# EAGLE design sparrow_ble (EAGLE 7.5.0)
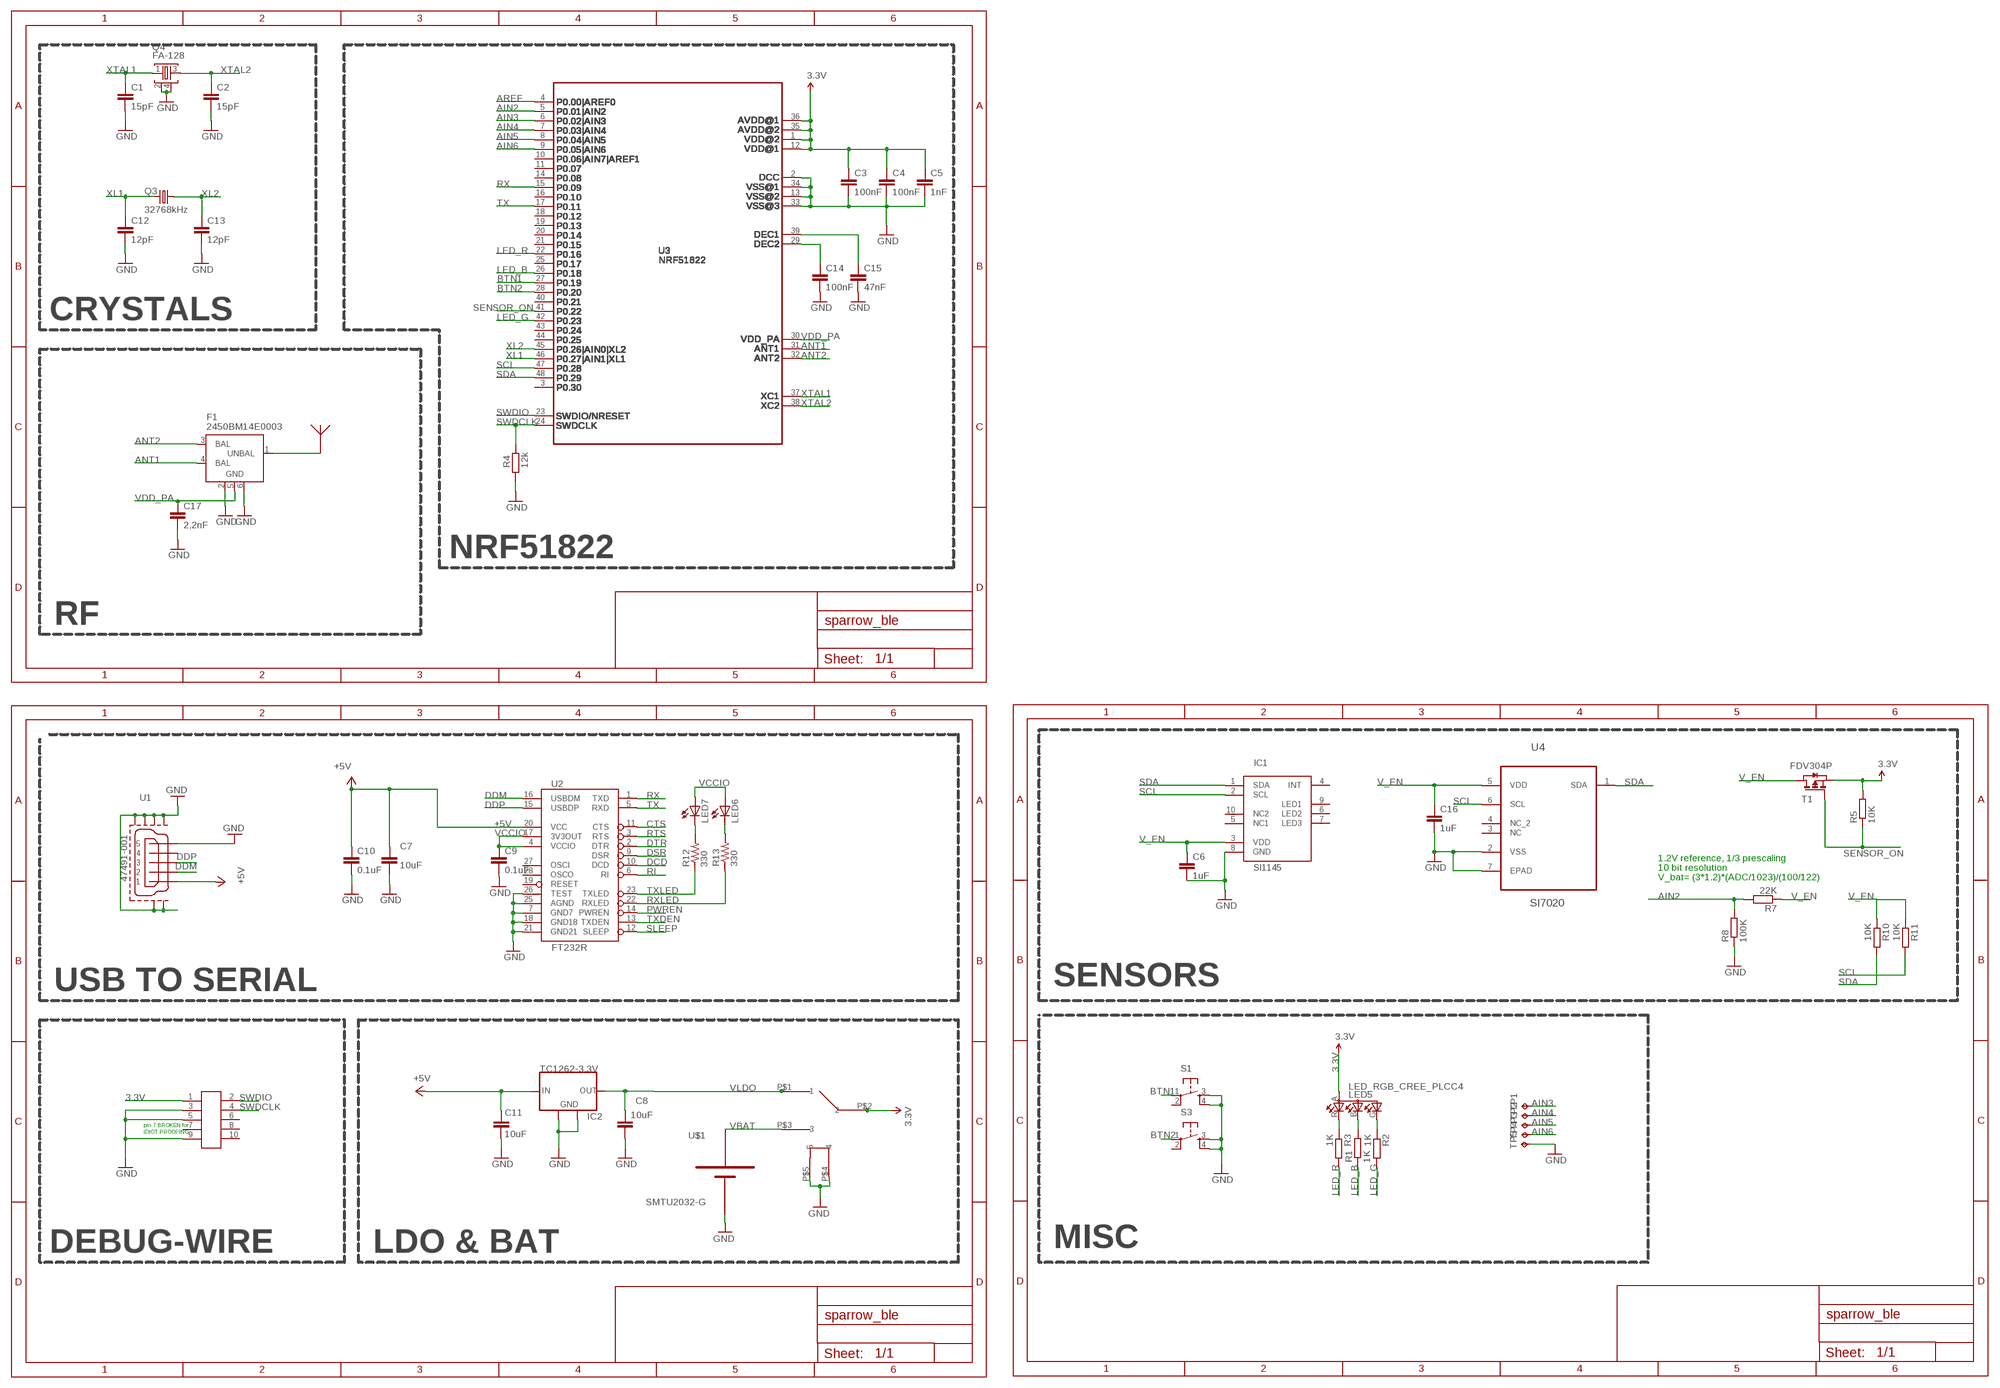
[diagram p0: schematic, sheet 1]

## Parts
C1  15pF  C-EUC0402  [C0402]
C2  15pF  C-EUC0402  [C0402]
C3  100nF  C-EUC0402  [C0402]
C4  100nF  C-EUC0402  [C0402]
C5  1nF  C-EUC0402  [C0402]
C6  1uF  C-EUC0402  [C0402]
C7  10uF  C-EUC0402  [C0402]
C8  10uF  C-EUC0402  [C0402]
C9  0.1uF  CAP0402-CAP  [0402-CAP]
C10  0.1uF  CAP0402-CAP  [0402-CAP]
C11  10uF  C-EUC0402  [C0402]
C12  12pF  C-EUC0402  [C0402]
C13  12pF  C-EUC0402  [C0402]
C14  100nF  C-EUC0402  [C0402]
C15  47nF  C-EUC0402  [C0402]
C16  1uF  C-EUC0402  [C0402]
C17  2,2nF  C-EUC0402  [C0402]
F1  2450BM14E0003  2450BM15A0002  [2450BM15A0002]
IC1  SI1145  [QFN10]
IC2  TC1262-3.3V  MCP1825S-SOT223  [SOT223]
J3  SMALL_HEADER_5X2  [SAMTEC_5X2]
LED5  LED_RGB_CREE_PLCC4  [P-LCC-4-4]
LED6  LEDCHIP-LED0603  [CHIP-LED0603]
LED7  LEDCHIP-LED0603  [CHIP-LED0603]
Q3  32768kHz  FC-12M  [FC-12M]
Q4  FA-128  [FA-128]
R1  1K  R-EU_R0402  [R0402]
R2  1K  R-EU_R0402  [R0402]
R3  1K  R-EU_R0402  [R0402]
R4  12k  R-EU_R0402  [R0402]
R5  10K  R-EU_R0402  [R0402]
R7  22K  R-EU_R0402  [R0402]
R8  100K  R-EU_R0402  [R0402]
R10  10K  R-EU_R0402  [R0402]
R11  10K  R-EU_R0402  [R0402]
R12  330  RESISTOR0402-RES  [0402-RES]
R13  330  RESISTOR0402-RES  [0402-RES]
S1  TAC_SWITCHSMD  [TACTILE-SWITCH-SMD]
S3  TAC_SWITCHSMD  [TACTILE-SWITCH-SMD]
T1  FDV304P  PMOSSOT23  [SOT-23]
TP1  TPTP16R  [TP16R]
TP2  TPTP16R  [TP16R]
TP3  TPTP16R  [TP16R]
TP4  TPTP16R  [TP16R]
TP5  TPTP16R  [TP16R]
U1  47491-001  [47491-0001]
U2  FT232R  FT232RLSSOP  [SSOP28DB]
U3  NRF51822  [NRF51822-QFN48]
U4  SI7020  SHT21  [DFN300X300X110-7N]
U8  ANTENNA  [ANTPACK]
U$1  SMTU2032-G  [SMTU2032-G]
U$2  SWITCH  [PCM12]

## Nets
3.3V: C3.1 C4.1 C5.1 J3.1 LED5.A(A2) R5.2 T1.2(S) U3.1 U3.12 U3.35 U3.36 U$2.P$2
+5V [power]: C7.1 C10.1 C11.1 IC2.1(IN) U1.1 U2.20(VCC)
AIN2: R7.2 R8.2 U3.5
AIN3: TP1.TP U3.6
AIN4: TP2.TP U3.7
AIN5: TP3.TP U3.8
AIN6: TP4.TP U3.9
ANT1: F1.4(BAL) U3.31
ANT2: F1.3(BAL) U3.32
AREF: U3.4
BTN1: S1.1 U3.27
BTN2: S3.1 U3.28
CTS: U2.11(CTS)
DCD: U2.10(DCD)
DDM: U1.2 U2.16(USBDM)
DDP: U1.3 U2.15(USBDP)
DSR: U2.9(DSR)
DTR: U2.2(DTR)
GND: C1.2 C2.2 C3.2 C4.2 C5.2 C6.2 C7.2 C8.2 C9.2 C10.2 C11.2 C12.2 C13.2 C14.2 C15.2 C16.2 C17.2 F1.2(GND) F1.6(GND) IC1.8(GND) IC2.2(GND) IC2.4(GND) J3.3 J3.5 J3.9 Q4.2 Q4.4 R4.1 R8.1 S1.3 S1.4 S3.3 S3.4 TP5.TP U1.5 U1.GND1 U1.GND2 U1.GND3 U1.GND4 U1.GND5 U1.GND6 U2.7(GND7) U2.18(GND18) U2.21(GND21) U2.25(AGND) U2.26(TEST) U3.2 U3.13 U3.33 U3.34 U4.2(VSS) U4.7(EPAD) U$1.2 U$2.P$4 U$2.P$5
LED_B: R1.1 U3.26
LED_G: R2.2 U3.42
LED_R: R3.2 U3.22
N$1: LED5.R(CRED) R3.1
N$2: LED5.G(CGREEN) R2.1
N$3: C14.1 U3.29
N$4: C15.1 U3.39
N$5: LED7.C R12.2
N$6: LED6.C R13.2
N$9: LED5.B(CBLUE) R1.2
N$10: F1.1(UNBAL) U8.P$1
PWREN: U2.14(PWREN)
RI: U2.6(RI)
RTS: U2.3(RTS)
RX: U2.1(TXD) U3.15
RXLED: R13.1 U2.22(RXLED)
SCL: IC1.2(SCL) R11.2 U3.47 U4.6(SCL)
SDA: IC1.1(SDA) R10.2 U3.48 U4.1(SDA)
SENSOR_ON: R5.1 T1.3(G) U3.41
SLEEP: U2.12(SLEEP)
SWDCLK: J3.4 R4.2 U3.24
SWDIO: J3.2 U3.23
TX: U2.5(RXD) U3.17
TXDEN: U2.13(TXDEN)
TXLED: R12.1 U2.23(TXLED)
V_EN: C6.1 C16.1 IC1.3(VDD) R7.1 R10.1 R11.1 T1.1(D) U4.5(VDD)
VBAT: U$1.1 U$2.P$3
VCCIO: C9.1 LED6.A LED7.A U2.4(VCCIO) U2.17(3V3OUT)
VDD_PA: C17.1 F1.5(GND) U3.30
VLDO: C8.1 IC2.3(OUT) U$2.P$1
XL1: C12.1 Q3.2 U3.46
XL2: C13.1 Q3.1 U3.45
XTAL1: C1.1 Q4.1 U3.37
XTAL2: C2.1 Q4.3 U3.38
Unconnected: IC1.4(INT) IC1.5(NC1) IC1.6(LED2) IC1.7(LED3) IC1.9(LED1) IC1.10(NC2) J3.6 J3.7 J3.8 J3.10 S1.2 S3.2 U1.4 U2.19(RESET) U2.27(OSCI) U2.28(OSCO) U3.3 U3.10 U3.11 U3.14 U3.16 U3.18 U3.19 U3.20 U3.21 U3.25 U3.40 U3.43 U3.44 U4.3(NC) U4.4(NC_2)

## Notes on the sheet
- CRYSTALS
- NRF51822
- RF
- 1.2V reference, 1/3 prescaling
- 10 bit resolution
- V_bat= (3*1.2)*(ADC/1023)/(100/122)
- USB TO SERIAL | SENSORS
- pin 7 BROKEN for
- IDIOT PROOFING
- DEBUG-WIRE | LDO & BAT | MISC

## Library data of the parts
C1-C6 C12-C17 = resistor:C-EU: CAPACITOR, European symbol
C7 C8 C11 = rcl:C-EU: CAPACITOR, European symbol
C9 C10 = SparkFun:CAP: Capacitor Standard 0603 ceramic capacitor, and 0.1" leaded capacitor.
F1 = johanson:2450BM15A0002: 2.45 GHz Impedance Matched Balun-Filter For TI CC253X/CC2540 Chipset family Data sheet <http://www.johansontechnology.com/images/stories/ip/baluns/balun_filter_combo_matched_2450bm15a0002_v8.pdf>
IC1 = dan:SI1145
IC2 = Spark:MCP1825S: 500 mA, Low Voltage, Low Quiescent Current LDO Regulator
J3 = 0andrei_custom:SMALL_HEADER_5X2
LED5 = led:LED_RGB_CREE_PLCC4
LED6 LED7 = led:LED: LED OSRAM: - CHIPLED LG R971, LG N971, LY N971, LG Q971, LY Q971, LO R971, LY R971 LH N974, LH R974 LS Q976, LO Q976, LY Q976 LO Q996 - Hyper CHIPLED LW Q18S LB Q993, LB Q99A, LB R99A - SideLED LS A670, LO A670, LY A670, LG A670, LP A670 LB A673, LV A673, LT A673, LW A673 LH A674 LY A675 LS A676, LA A676, LO A676, LY A676, LW A676 LS A679, LY A679, LG A679 - Hyper Micro SIDELED® LS Y876, LA Y876, LO Y876, LY Y876 LT Y87S - SmartLED LW L88C, LW L88S LB L89C, LB L89S, LG L890 LS L89K, LO L89K, LY L89K LS L896, LA L896, LO L896, LY L896 - TOPLED LS T670, LO T670, LY T670, LG T670, LP T670 LSG T670, LSP T670, LSY T670, LOP T670, LYG T670 LG T671, LOG T671, LSG T671 LB T673, LV T673, LT T673, LW T673 LH T674 LS T676, LA T676, LO T676, LY T676, LB T676, LH T676, LSB T676, LW T676 LB T67C, LV T67C, LT T67C, LS T67K, LO T67K, LY T67K, LW E67C LS E67B, LA E67B, LO E67B, LY E67B, LB E67C, LV E67C, LT E67C LW T67C LS T679, LY T679, LG T679 LS T770, LO T770, LY T770, LG T770, LP T770 LB T773, LV T773, LT T773, LW T773 LH T774 LS E675, LA E675, LY E675, LS T675 LS T776, LA T776, LO T776, LY T776, LB T776 LHGB T686 LT T68C, LB T68C - Hyper Mini TOPLED® LB M676 - Mini TOPLED Santana® LG M470 LS M47K, LO M47K, LY M47K Source: http://www.osram.convergy.de LUXEON: - LUMILED® LXK2-PW12-R00, LXK2-PW12-S00, LXK2-PW14-U00, LXK2-PW14-V00 LXK2-PM12-R00, LXK2-PM12-S00, LXK2-PM14-U00 LXK2-PE12-Q00, LXK2-PE12-R00, LXK2-PE12-S00, LXK2-PE14-T00, LXK2-PE14-U00 LXK2-PB12-K00, LXK2-PB12-L00, LXK2-PB12-M00, LXK2-PB14-N00, LXK2-PB14-P00, LXK2-PB14-Q00 LXK2-PR12-L00, LXK2-PR12-M00, LXK2-PR14-Q00, LXK2-PR14-R00 LXK2-PD12-Q00, LXK2-PD12-R00, LXK2-PD12-S00 LXK2-PH12-R00, LXK2-PH12-S00 LXK2-PL12-P00, LXK2-PL12-Q00, LXK2-PL12-R00 Source: www.luxeon.com KINGBRIGHT: KA-3528ASYC Source: www.kingbright.com
Q3 = crystal:FC-12M: kHz RANGE CRYSTAL UNIT LOW PROFILE SMD Source: Epson Toyocom FC-12M.pdf
Q4 = smartwatch:FA-: MHz RANGE CRYSTAL UNIT Source: Epson Toyocom
R1-R3 = rcl:R-EU_: RESISTOR, European symbol
R4 R5 R7 R8 R10 R11 = resistor:R-EU_: RESISTOR, European symbol
R12 R13 = SparkFun:RESISTOR: Resistor Basic schematic elements and footprints for 0603, 1206, and PTH 1/10th watt (small) resistors.
S1 S3 = SparkFun-Electromechanical:TAC_SWITCH: Momentary Switch Button commonly used for reset or general input. Spark Fun Electronics SKU : COM-00097 SMT- SWCH-08247
T1 = zetex:PMOSSOT23: MOS FET; OC_FARNELL: unknown; OC_NEWARK: unknown
TP1-TP5 = testpad:TP: Test pad
U1 = usb_con-update:47491-001
U2 = SparkFun:FT232RL: USB UART FT232RL 4th Generation USB UART (USB <-> Serial) Controller. Spark Fun Electronics SKU : COM-00650
U3 = 0andrei_custom:NRF51822: nRF51822 ARM SoC with Bluetooth LE
U4 = sensirion:SHT21: SENSOR, HUMIDITY & TEMP; MPN: SHT21; OC_FARNELL: 1855468; OC_NEWARK: 20T1172; PACKAGE: DFN-6; SUPPLIER: SENSIRION
U8 = 0andrei_custom:ANTENNA
U$1 = dan:SMTU2032-G
U$2 = dan:SWITCH

## Net classes
1 power: width 0.61 mm

## Board
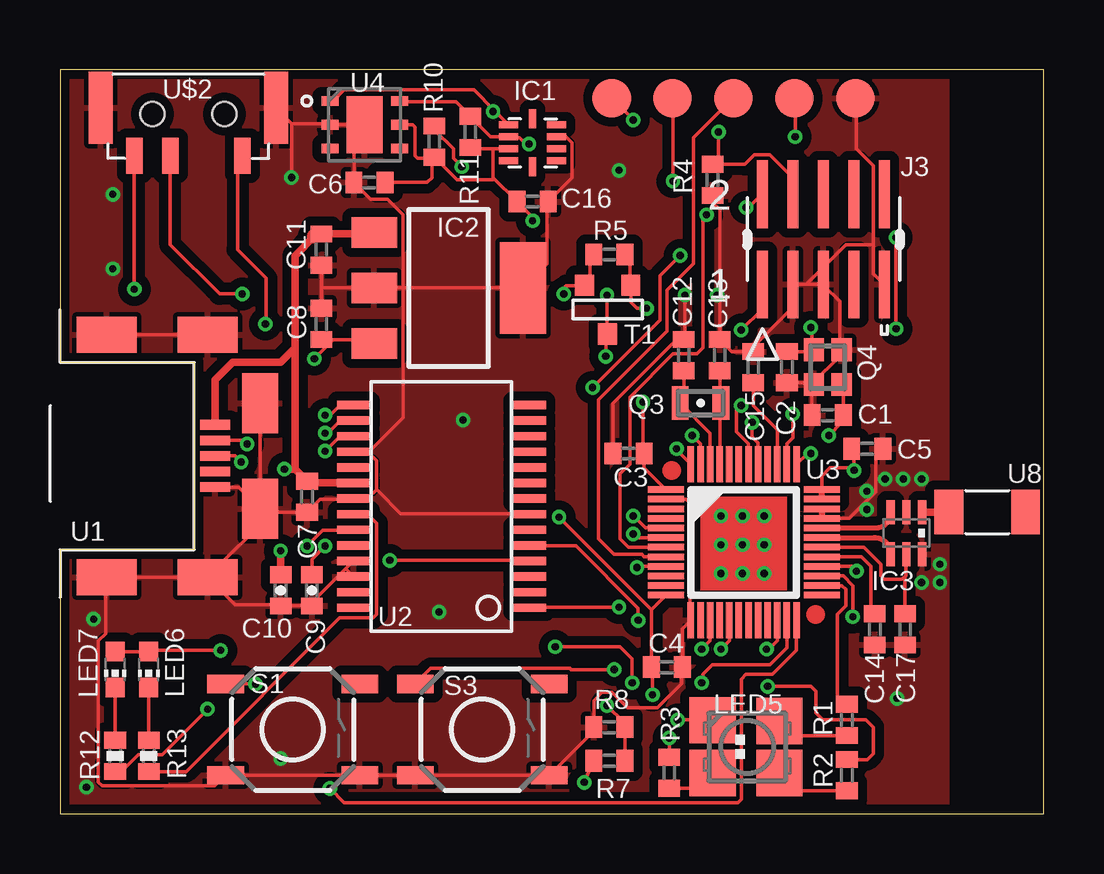
[diagram p1: board, top side]
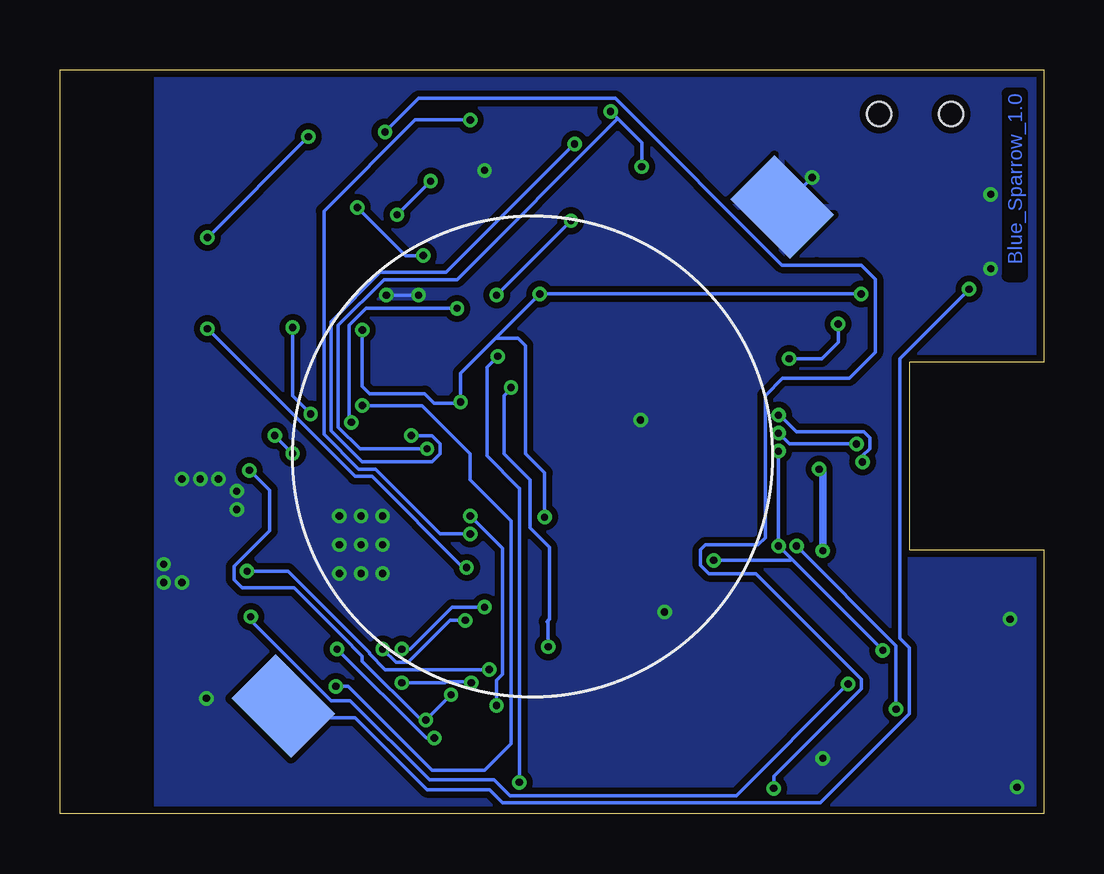
[diagram p2: board, bottom side, seen from below]

Size 41 x 31 mm. Coordinates in mm from the lower left corner, seen from the top.
Outline: 0,0 41,0 41,31 0,31 0,18.8 5.6,18.8 5.6,11 0,11 0,0
Copper layers (1*16): Top 0.035mm / dielectric 1.5mm / Bottom 0.035mm
Design rules "default": minimum track width 0.15mm, minimum drill 0.3mm, track to track 0.15mm, track to pad 0.15mm, pad to pad 0.15mm, via to via 0.15mm, smd to smd 0.15mm, copper to edge 0.3mm, drill to drill 0.2mm, minimum pad ring 0.2mm, minimum via ring 0.15mm, stop-mask expansion 0.075mm, vias tented up to drill 0mil, thermal gap 0.2mm

### Footprints (pad centres in the part's own frame; a part is rotated, then mirrored left to right if it is on the bottom)
C0402 = smd 0.7 x 0.9: 1 -0.65,0; 2 0.65,0
0402-CAP = smd 0.7 x 0.9: 1 -0.65,0; 2 0.65,0
2450BM15A0002 = smd 0.35 x 1: 1 -0.65,-0.875; 2 0,-0.875; 3 0.65,-0.875; 4 0.65,0.875; 5 0,0.875; 6 -0.65,0.875
QFN10 = smd 0.8 x 0.3: 1 1,1.5; 2 1,1; 3 1,0.5; 4 1,0; 6 3,0; 7 3,0.5; 8 3,1; 9 3,1.5 | smd 0.3 x 0.8: 5 2,-0.25; 10 2,1.75
SOT223 = smd 1.27 x 1.905: 1 -2.311,-3.099; 2 0,-3.099; 3 2.311,-3.099 | smd 3.81 x 1.905: 4 0,3.099
SAMTEC_5X2 = smd 0.457 x 2.819: 1 -2.54,-1.88; 2 -2.54,1.88; 3 -1.27,-1.88; 4 -1.27,1.88; 5 0,-1.88; 6 0,1.88; 7 1.27,-1.88; 8 1.27,1.88; 9 2.54,-1.88; 10 2.54,1.88
P-LCC-4-4 = smd 1.93 x 1.93: A -1.088,-1.39; B -1.063,1.39; G 1.113,1.39; R 1.113,-1.39
CHIP-LED0603 = smd 0.8 x 0.8: A 0,-0.75; C 0,0.75
FC-12M = smd 0.7 x 1.4: 1 -0.85,0; 2 0.85,0
FA-128 = smd 0.95 x 0.85: 1 -0.725,-0.575; 2 0.725,-0.575; 3 0.725,0.575; 4 -0.725,0.575
R0402 = smd 0.7 x 0.9: 1 -0.65,0; 2 0.65,0
0402-RES = smd 0.7 x 0.9: 1 -0.65,0; 2 0.65,0
TACTILE-SWITCH-SMD = smd 1.524 x 0.762: 1 -2.794,1.905; 2 2.794,1.905; 3 -2.794,-1.905; 4 2.794,-1.905
SOT-23 = smd 0.787 x 0.889: 1 0.025,-1.016; 2 -0.94,1.016; 3 0.991,1.016
TP16R = smd 1.6 x 1.6: TP 0,0
47491-0001 = smd 1.25 x 0.4: 1 6.475,5.2; 2 6.475,4.55; 3 6.475,3.9; 4 6.475,3.25; 5 6.475,2.6 | smd 2.5 x 1.5: GND1 1.95,8.95; GND2 6.15,8.95; GND5 6.15,-1.15; GND6 1.95,-1.15 | smd 1.5 x 2.5: GND3 8.35,6.1; GND4 8.35,1.7
SSOP28DB = smd 0.348 x 1.397: 1 -4.225,-3.656; 2 -3.575,-3.656; 3 -2.925,-3.656; 4 -2.275,-3.656; 5 -1.625,-3.656; 6 -0.975,-3.656; 7 -0.325,-3.656; 8 0.325,-3.656; 9 0.975,-3.656; 10 1.625,-3.656; 11 2.275,-3.656; 12 2.925,-3.656; 13 3.575,-3.656; 14 4.225,-3.656; 15 4.225,3.656; 16 3.575,3.656; 17 2.925,3.656; 18 2.275,3.656; 19 1.625,3.656; 20 0.975,3.656; 21 0.325,3.656; 22 -0.325,3.656; 23 -0.975,3.656; 24 -1.625,3.656; 25 -2.275,3.656; 26 -2.925,3.656; 27 -3.575,3.656; 28 -4.225,3.656
NRF51822-QFN48 = smd 1.5 x 0.27: 1 -0.25,0; 2 -0.25,-0.4; 3 -0.25,-0.8; 4 -0.25,-1.2; 5 -0.25,-1.6; 6 -0.25,-2; 7 -0.25,-2.4; 8 -0.25,-2.8; 9 -0.25,-3.2; 10 -0.25,-3.6; 11 -0.25,-4; 12 -0.25,-4.4; 25 6.25,-4.4; 26 6.25,-4; 27 6.25,-3.6; 28 6.25,-3.2; 29 6.25,-2.8; 30 6.25,-2.4; 31 6.25,-2; 32 6.25,-1.6; 33 6.25,-1.2; 34 6.25,-0.8; 35 6.25,-0.4; 36 6.25,0 | smd 0.27 x 1.5: 13 0.8,-5.45; 14 1.2,-5.45; 15 1.6,-5.45; 16 2,-5.45; 17 2.4,-5.45; 18 2.8,-5.45; 19 3.2,-5.45; 20 3.6,-5.45; 21 4,-5.45; 22 4.4,-5.45; 23 4.8,-5.45; 24 5.2,-5.45; 37 5.2,1.05; 38 4.8,1.05; 39 4.4,1.05; 40 4,1.05; 41 3.6,1.05; 42 3.2,1.05; 43 2.8,1.05; 44 2.4,1.05; 45 2,1.05; 46 1.6,1.05; 47 1.2,1.05; 48 0.8,1.05
DFN300X300X110-7N = smd 0.711 x 0.406: 1 -1.448,0.991; 2 -1.448,0; 3 -1.448,-0.991; 4 1.448,-0.991; 5 1.448,0; 6 1.448,0.991 | smd 1.499 x 2.388: 7 0,0
ANTPACK = smd 1.2 x 1.85: P$1 -1.6,0; P$2 1.6,0
SMTU2032-G = smd 2.6 x 3.5: 1 -14.7,0; 2 14.7,0
PCM12 = smd 0.7 x 1.5: P$1 0,0; P$2 3,0; P$3 4.5,0 | smd 1 x 3: P$4 -1.4,-2; P$5 5.9,-2 | hole 1: 0.75,-1.75; 3.75,-1.75

### Placement (x,y rotation side)
C1  32,16.6 180 top
C2  30.3,18.6 270 top
C3  23.7,15 180 top
C4  25.3,6.1 0 top
C5  33.65,15.2 0 top
C6  12.9,26.3 180 top
C7  10.3,13.2 270 top
C8  10.9,20.4 90 top
C9  10.5,9.3 270 top
C10  9.2,9.3 270 top
C11  10.9,23.5 270 top
C12  26,19.1 90 top
C13  27.5,19.1 90 top
C14  33.97,7.67 270 top
C15  28.9,18.6 90 top
C16  19.7,25.5 0 top
C17  35.23,7.67 270 top
F1  35.28,11.68 180 top
IC1  17.7,27.2 0 top
IC2  16.2,21.9 270 top
J3  31.82,23.93 0 top
LED5  28.6,2.8 270 top
LED6  3.7,6 180 top
LED7  2.3,6 180 top
Q3  26.7,17.1 180 top
Q4  32,18.6 90 top
R1  32.8,3.9 270 top
R2  32.8,1.6 90 top
R3  25.4,1.7 90 top
R4  27.2,26.4 90 top
R5  22.9,23.3 180 top
R7  22.9,2.2 0 top
R8  22.9,3.6 0 top
R10  15.6,28 90 top
R11  17.1,28.4 90 top
R12  2.3,2.4 90 top
R13  3.7,2.4 90 top
S1  9.7,3.5 0 top
S3  17.6,3.5 0 top
T1  22.8,21 0 top
TP1  23,29.8 0 top
TP2  25.54,29.8 0 top
TP3  28.08,29.8 0 top
TP4  30.62,29.8 0 top
TP5  33.16,29.8 0 top
U1  0,11 0 top
U2  15.9,12.8 90 top
U3  25.5,13.5 0 top
U4  12.7,28.7 0 top
U8  38.65,12.56 0 top
U$1  21.29,14.88 45 bottom
U$2  7.6,27.4 180 top

### Tracks (layer width: path | path; a pad name or v marks a point on that pad's centre or on a via)
3.3V  (via drill 0.3)
  Top 0.15: 24.65,8.5 C4.1 24.7,6.05 v24.7,4.95 | U3.12 24.65,8.5 | v25.75,3.9 LED5.A | v33.1,14.3 33.1,14.25 v33.1,14.3 | v33.1,14.3 33.1,14.35 | U3.1 24.35,14.4 C3.1 24.3,15.05 v24.3,17.15 | 21.9,22.05 T1.2 | v28.4,20.15 29.25,21 29.25,22 J3.1 | v20.8,12.35 24.6,8.55 24.65,8.5 | v21,21.65 21,21.9 21.1,22 21.9,22 21.88,22 T1.2 | R5.2 22.25,23.25 22.1,23.1 22.1,22.26 T1.2 | 33.1,14.35 v33.1,14.3 | v33.1,14.3 33.1,14.35 | 33.1,14.35 33.1,14.4 | 33.1,14.4 33.1,14.9 33.1,15.4 C5.1 | 33.1,14.4 33.1,14.35 | 33.1,14.35 v33.1,14.3 | U3.36 31.75,14.05 32.1,14.4 33,14.4 v33.1,14.3 | 33.1,14.4 v33.1,14.3 | v7.6,21.65 6.65,21.65 4.6,23.7 U$2.P$2 4.5,27.5
  Top 0.254: U3.35 U3.36
  Bottom 0.15: v24.7,4.95 v25.75,3.9 25.8,3.95 26,3.95 28.4,6.35 28.4,6.55 29.25,7.4 31.25,9.4 33.4,9.4 33.75,9.75 33.75,9.9 33.75,10.3 33.1,10.95 | v7.6,21.65 v21,21.65 21.05,21.6 22.8,19.85 | 22.8,19.85 24.3,18.35 v24.3,17.15 24.3,17.1 25.4,17.1 25.8,17.5 28.1,17.5 28.4,17.8 v28.4,20.15 | v20.8,12.35 20.8,12.7 20.8,14.2 21.6,15 21.6,18.6 21.6,19.5 21.9,19.8 22.75,19.8 22.8,19.85 | 22.8,19.85 22.8,19.8
  Bottom 0.152: v33.1,14.3 32.26,13.46 32.26,11.79 33.1,10.95
+5V  (via drill 0.3)
  Top 0.305: 13.05,24.15 C11.1 | v9.2,10.95 C10.1 | 9.8,14.35 v9.35,14.35 | C7.1 9.8,14.35 | 10.6,24.05 9.8,23.25 9.8,19.4 | 9.8,19.4 9.8,14.65 9.8,14.35 | U2.20 10.2,13.78 | U1.1 6.47,18.07 7.2,18.8 9.2,18.8 9.8,19.4
  Top 0.406: 10.2,13.78 10.2,13.8 10.3,13.8 C7.1
  Top 0.61: 13.05,24.15 IC2.1 | 10.6,24.05 C11.1
  Bottom 0.305: v9.2,10.95 9.2,14.2 v9.35,14.35
AIN2  (via drill 0.3)
  Top 0.15: R7.2 R8.2 23.5,3.65 23.5,3.8 v22.8,4.5 | v23.9,12.4 24.4,11.9 U3.5
  Bottom 0.15: v22.8,4.5 22.8,5.55 22.55,5.8 22.55,11.05 v23.9,12.4
AIN3  (via drill 0.3)
  Top 0.15: U3.6 24.05,11.5 v23.9,11.65 | TP1.TP v23.9,28.9
  Bottom 0.15: v23.9,11.65 25.15,11.65 27.85,14.35 28.55,14.35 30,15.8 30,25.1 26.2,28.9 v23.9,28.9
AIN4  (via drill 0.3)
  Top 0.15: U3.7 23.7,11.1 23.35,11.45 23.35,14.15 23.75,14.55 23.75,17.35 25.55,19.15 26.55,19.15 26.8,19.4 26.8,24.8 v26.95,24.95 | v25.55,26.35 TP2.TP
  Bottom 0.15: v25.55,26.35 v26.95,24.95
AIN5
  Top 0.15: U3.8 24.35,10.7 24.25,10.8 23.15,10.8 23.1,10.8 22.45,11.45 22.45,13.5 22.45,17.25 25.3,20.1 25.3,21.8 26.4,22.9 26.4,28.15 28.05,29.8 TP3.TP
AIN6  (via drill 0.3)
  Top 0.15: U3.9 24.1,10.3 v24.05,10.25 | v34.85,24 v34.85,20.2 | v30.65,28.2 30.65,29.8 TP4.TP
  Bottom 0.15: v24.05,10.25 24.2,10.25 28,14.05 28.7,14.05 v34.85,20.2 | v30.65,28.2 v34.85,24
ANT1
  Top 0.2: U3.31 33.94,11.5 arc-90 F1.4
ANT2
  Top 0.2: U3.32 34,11.9 arc90 34.65,12.55
  Top 0.254: F1.3 F1.3 arc-90 34.65,12.55
BTN1  (via drill 0.3)
  Top 0.15: U3.27 32.65,9.9 33.05,9.5 v33.05,8.2 | v8.15,5.4 6.95,5.4 S1.1
  Bottom 0.15: v8.15,5.4 12.8,0.75 22.25,0.75 22.3,0.8 22.9,1.4 25.6,1.4 28.9,4.7 29.7,4.7 33.05,8.05 v33.05,8.2
BTN2  (via drill 0.3)
  Top 0.15: U3.28 33,10.3 v33.2,10.1 | v23.1,6 21.3,6 21.25,6.05 15.45,6.05 14.85,5.45 S3.1
  Bottom 0.15: v33.2,10.1 31.5,10.1 28.1,6.7 28.1,6.65 27.45,6 v23.1,6
DDM  (via drill 0.3)
  Top 0.15: v7.8,15.4 7.65,15.55 6.5,15.55 U1.2 | v11.05,15.85 11.15,15.85 11.65,16.35 12.2,16.35 U2.16
  Bottom 0.15: v7.8,15.4 10.6,15.4 v11.05,15.85
DDP  (via drill 0.3)
  Top 0.15: v7.55,14.65 7.3,14.9 6.5,14.9 U1.3 | v11.05,16.6 11.25,16.6 11.65,17 12.2,17 U2.15
  Bottom 0.15: v7.55,14.65 7.55,14.9 7.25,15.2 7.25,15.6 7.25,15.65 7.5,15.9 10.3,15.9 11,16.6 v11.05,16.6
GND  (via drill 0.3)
  Top 0.15: 11.9,10.2 12.2,10.5 U2.25 | 11.9,10.2 10.55,8.85 10.55,8.7 C9.2 C10.2 9.15,8.7 7.3,8.7 6.2,9.8 U1.GND5 | U2.26 12.2,9.9 11.95,10.15 11.9,10.2 | U1.GND5 U1.GND6 1.9,9.8 1.9,7.5 1.6,7.2 1.6,1.3 1.75,1.15 6.45,1.15 6.85,1.55 S1.3 6.95,1.6 12.45,1.6 S1.4 12.55,1.6 S3.3 14.85,1.6 20.35,1.6 S3.4 22.25,3.45 R8.1 22.25,3.65 22.25,4.7 22.6,5.05 23,5.05 23.65,4.4 24.9,4.4 25.9,5.4 25.9,6.05 C4.2 25.95,7.7 U3.13 26.25,8.1 26.25,12.95 26.1,13.1 U3.2 | U1.GND1 U1.GND2 6.2,19.9 | U1.GND4 8.5,12.55 C7.2 10.35,12.6 10.85,13.1 12.2,13.1 U2.21 12.3,13.15 12.85,13.15 13.2,13.5 | U1.5 6.5,13.6 7.45,13.6 8.3,12.75 U1.GND4 | 13.2,13.5 13.2,14.7 12.85,15.05 12.25,15.05 U2.18 12.9,15.1 14.3,16.5 14.3,21.85 14.3,21.9 | U2.7 19.55,12.5 14.2,12.5 13.25,13.45 13.2,13.5 | U1.GND4 8.35,12.8 U1.GND3 8.3,17.15 | U1.GND5 6.2,9.9 8.8,12.5 U1.GND4 | IC1.8 21.1,28.2 21.35,27.95 21.35,26.5 C16.2 20.3,25.45 20.3,22.9 IC2.4 | IC2.4 | C11.2 10.9,21.9 | 10.9,21.9 C8.2 | IC2.2 10.95,21.9 10.9,21.9 | IC2.2 | IC2.2 | IC2.2 | 14.3,21.9 19.25,21.9 IC2.4 | 14.3,21.9 13.15,21.9 IC2.2 | IC2.4 | IC2.4 | 9.65,28.75 11.2,28.75 U4.2 11.3,28.7 U4.7 12.25,28.65 C6.2 12.3,26.25 12.95,25.6 13.65,25.6 14.3,24.95 14.3,21.95 14.3,21.9 | 9.65,28.75 U$2.P$4 8.95,29.4 | v9.65,26.5 9.65,28.7 9.65,28.75 | Q4.4 31.4,17.85 31.35,17.8 C1.2 31.3,16.95 | Q4.4 31.35,17.9 32.55,19.1 32.55,19.3 Q4.2 32.5,19.35 32.5,21.35 31.85,22 J3.5 31.8,22.05 31.15,22.05 | 33.9,23.7 33.9,22.5 34.35,22.05 J3.9 | 33.9,23.7 33.9,27 33.2,27.7 33.2,29.8 TP5.TP | C3.2 23.05,17.1 25.7,19.75 C12.2 26.05,19.8 v26.05,21.6 | 31.15,22.05 30.6,22.05 J3.3 30.5,22 30.5,21.05 28.75,19.3 C15.2 28,19.25 27.55,19.7 C13.2 27.5,21.6
  Top 0.15: R4.1 27.2,25.45 27.5,25.15 27.5,21.6 | v27.4,21.6 27.45,21.6 27.5,21.6 | 33.9,23.7 33.85,23.7 32.75,23.7 31.15,22.1 31.15,22.05 | C2.2 31.35,17.95 31.4,17.9 Q4.4 | U3.33 32.9,12.3 34,13.4 34,15.1 C5.2
  Top 0.254: U3.34 U3.33
  Bottom 0.15: v9.65,26.5 10.85,25.3 U$1.2 | v27.4,21.6 v26.05,21.6
  other vias: 16.8,16.4 15.8,8.4 9.2,2.3 1.4,8.1 1.1,1.1 2.2,25.8 2.2,22.7 23.3,26.8 34.9,4.8 27.55,12.4 28.45,12.4 29.35,12.4 29.35,11.2 28.45,11.2 27.55,11.2 27.55,10 28.45,10 29.35,10 36.68,9.63 35.92,13.94 35.15,13.94 34.39,13.94 36.68,10.39 33.63,13.44 33.63,12.67 35.92,9.63
  pour Top: 26.7,13.2 30.3,13.2 30.3,9.6 30.3,9.3 26.7,9.3
  pour Top (isolate 0.381): 0,31 0,0 37.02,0 37.02,31
  pour Bottom (isolate 0.254): 0,0 0,31 37.02,31 37.02,0
LED_B
  Top 0.15: U3.26 32.6,9.5 32.75,9.35 32.75,8.65 32.4,8.3 32.4,4.9 32.8,4.5 R1.1
LED_G  (via drill 0.3)
  Top 0.15: U3.42 28.7,15.4 28.2,15.9 28.2,16.3 28.2,16.8 v28.4,17 | R2.2 33.65,2.25 33.9,2.5 33.9,3.6 33.6,3.9 31.8,3.9 31.5,4.2 31.5,5.1 31.3,5.3 v29.5,5.3
  Bottom 0.15: v28.4,17 25.9,17 23.9,15 23.9,13.9 22.3,12.3 22.2,12.2 22.2,2.9 23.3,1.8 24.5,1.8 25.5,1.8 29,5.3 v29.5,5.3
LED_R  (via drill 0.3)
  Top 0.15: v25.4,3.15 R3.2 | v29.45,6.85 29.55,6.85 29.9,7.2 U3.22
  Bottom 0.15: v25.4,3.15 25.75,3.15 v29.45,6.85
N$1
  Top 0.15: R3.1 26.6,1.05 27.2,1.65 LED5.R
N$2
  Top 0.15: R2.1 30.7,0.95 30,1.65 LED5.G
N$3
  Top 0.15: U3.29 33.4,10.7 33.8,10.3 33.8,8.4 34,8.3 33.99,8.3 C14.1
N$4
  Top 0.15: C15.1 28.9,17 29.9,16 U3.39
N$5
  Top 0.15: R12.2 LED7.C
N$6
  Top 0.15: R13.2 LED6.C
N$9
  Top 0.15: R1.2 30.6,3.25 LED5.B
N$10
  Top 0.305: F1.1 U8.P$1 37.06,12.55 | 37.06,12.55 37.11,12.55 | 37.11,12.55 37.13,12.52 37.11,12.55 | 37.11,12.55 37.11,12.47 37.06,12.42 37.03,12.42 | U8.P$1 37.06,12.55
RX  (via drill 0.3)
  Top 0.15: v23.3,8.6 19.6,8.6 U2.1 | v26.75,6.85 27.1,7.2 U3.15
  Bottom 0.15: v23.3,8.6 24.65,8.6 26.4,6.85 v26.75,6.85
RXLED
  Top 0.15: R13.1 5.25,1.75 11.65,8.15 13.05,8.15 13.2,8.3 13.2,12.1 12.85,12.45 12.25,12.45 U2.22
SCL  (via drill 0.3)
  Top 0.15: U4.6 14.15,29.65 16.5,29.65 R11.2 17.15,29 17.95,28.2 IC1.2 18.75,28.15 19.15,28.15 19.4,27.9 v19.55,27.9 | U3.47 26.7,15.4 v26.35,15.75
  Bottom 0.15: v26.35,15.75 25.5,15.75 25.15,15.4 25.15,15 25.5,14.65 28.4,14.65 29.7,15.95 29.7,20.5 27.65,22.55 24.9,22.55 v19.55,27.9
SDA  (via drill 0.3)
  Top 0.15: IC1.1 18.1,29.3 | 18.1,29.3 17.25,30.15 11.85,30.15 11.4,29.7 11.3,29.7 U4.1 | R10.2 15.6,28.5 16.4,27.7 16.4,27.3 v16.75,26.95 | v18.05,29.25 18.1,29.3 | U3.48 25.7,15.15 v25.7,15.2
  Bottom 0.15: v16.75,26.95 16.75,27.95 17.75,28.95 | v18.05,29.25 17.75,28.95 | v25.7,15.2 28.5,15.2 29.4,16.1 29.4,20.35 27.5,22.25 24.45,22.25 17.8,28.9 17.75,28.95
SENSOR_ON  (via drill 0.3)
  Top 0.15: R5.1 23.75,23.1 23.75,22.05 T1.3 | 23.8,21.7 23.8,21.95 T1.3 | v28.85,16.3 28.85,15.7 29.1,15.45 U3.41 | v24.45,21.05 24.05,21.05 23.8,21.3 23.8,21.8 23.9,21.9 23.9,21.91 T1.3
  Bottom 0.15: v24.45,21.05 28.25,21.05 28.95,20.35 28.95,16.4 v28.85,16.3
SWDCLK  (via drill 0.3)
  Top 0.15: J3.4 30.55,25.85 30.55,26.5 29.6,27.45 28.95,27.45 28.55,27.05 R4.2 27.45,27.1 v27.45,28.4 | U3.24 30.7,6.85 30.7,6.8 29.7,5.8 28.6,5.8 28.4,5.6 28.4,4.55 28.4,0.6 28.25,0.45 11.85,0.45 v11.25,1.05
  Bottom 0.15: v11.25,1.05 11.25,1.55 7.6,5.2 7.6,5.6 12,10 13.95,10 14.3,10.35 14.3,11 14.1,11.2 11.9,11.2 11.6,11.5 11.6,17.2 11.6,17.42 11.58,17.44 10.88,18.14 8.1,18.14 7.72,18.52 7.02,19.22 7.02,22.27 7.6,22.85 9.45,22.85 10.9,22.85 17.85,29.8 26.05,29.8 v27.45,28.4
SWDIO  (via drill 0.3)
  Top 0.15: U3.23 30.3,6.95 30.3,6.9 29.6,6.2 27.2,6.2 26.8,5.8 26.8,5.4 v26.75,5.45 | v23.85,5.45 23.85,6 23.85,6.45 23.8,6.5 23.35,6.95 21.3,6.95 v20.65,6.95 | v22.2,17.75 25,20.55 25,22.4 v25.85,23.25 | v28.6,25.25 28.7,25.25 29.25,25.8 J3.2
  Bottom 0.15: v26.75,5.45 24.95,5.45 24.9,5.5 23.9,5.5 v23.85,5.45 | v25.85,23.25 26.6,23.25 v28.6,25.25 | 20.65,8.05 20.6,8.1 20.6,11.1 21.4,11.9 21.4,12.7 21.4,13.9 22.5,15 22.5,17.4 22.2,17.7 v22.2,17.75 | 20.65,8.05 20.7,8 | v20.65,6.95 20.65,8.05
TX  (via drill 0.3)
  Top 0.15: v24.1,8.05 24.1,8.55 21.5,11.15 19.6,11.15 U2.5 | v27.55,6.85 27.9,7.2 U3.17
  Bottom 0.15: v24.1,8.05 24.75,8.05 26.5,6.3 27,6.3 v27.55,6.85
TXLED  (via drill 0.3)
  Top 0.15: R12.1 2.55,1.75 3.25,2.45 4.25,2.45 v6.15,4.35 | v10.3,11.15 10.95,11.8 12.2,11.8 U2.23
  Bottom 0.15: v6.15,4.35 6.15,7 v10.3,11.15
V_EN  (via drill 0.3)
  Top 0.15: U4.5 14.25,28.7 14.7,28.7 14.8,28.6 14.8,27.4 14.9,27.3 15.5,27.3 | C6.1 13.65,26.3 15.3,26.3 15.5,26.5 15.5,27.25 | 18.05,27.7 17.15,27.7 R11.1 | 18.05,27.7 IC1.3 | v22.8,21.6 22.8,20 T1.1 22.75,19.95 v22.75,19.05 | v19.7,24.7 19.7,24.85 C16.1 19,25.55 18.1,26.45 | v21.85,1.3 R7.1 | 18.1,26.45 18.05,26.5 18.05,27.65 18.05,27.7 | 18.1,26.45 18.05,26.4 16.55,26.4 15.65,27.3 R10.1 15.5,27.25 | 15.5,27.3 15.6,27.4 | 15.5,27.3 15.6,27.3 | 15.5,27.25 15.5,27.3
  Bottom 0.15: v19.7,24.7 v22.8,21.6 | v21.85,1.3 21.85,11.8 21.85,13.45 21.85,13.55 21.9,13.6 23.2,14.9 23.2,18.6 v22.75,19.05
VBAT  (via drill 0.3)
  Top 0.15: v3.1,21.85 U$2.P$3
  Bottom 0.15: v3.1,21.85 6,18.95 6,7.3 5.6,6.9 5.6,4.15 9.3,0.45 22.45,0.45 22.55,0.45 23.1,1 25.7,1 28.7,4 29.9,4 30.35,4.45 31.65,4.45 U$1.1
VCCIO  (via drill 0.3)
  Top 0.15: LED7.A LED6.A 3.75,6.8 v6.7,6.8 | C9.1 10.5,10.6 v11.05,11.15 | v11.05,15.1 11.65,15.7 12.2,15.7 U2.17 | v13.75,10.55 19.55,10.55 U2.4
  Bottom 0.15: v11.05,15.1 v11.05,11.15 11,11.1 10.5,10.6 | 10.5,10.6 v6.7,6.8 | v13.75,10.55 10.55,10.55 10.5,10.6
VDD_PA
  Top 0.152: U3.30 33.5,11.1 34.21,10.39 34.21,9.91 34.37,9.75 35.1,9.75 35.26,9.91 | 35.26,9.91 35.26,10.78 F1.5 | C17.1 35.23,9.88 35.26,9.91
VLDO  (via drill 0.3)
  Top 0.15: 11.35,19.75 12.95,19.75 IC2.3 | 11.35,19.75 C8.1 | v10.6,18.95 11.35,19.7 11.35,19.75 | 7.57,27.29 7.75,27.47 7.67,27.47 U$2.P$1 7.4,27.2 7.4,23.5 8.6,22.3 8.6,20.44 v8.56,20.4
  Bottom 0.15: v10.6,18.95 9.25,18.95 8.6,19.6 8.56,19.64 v8.56,20.4
XL1
  Top 0.15: C12.1 26,17.25 Q3.2 25.9,17.05 27.1,15.85 U3.46
XL2
  Top 0.15: C13.1 27.5,17.15 Q3.1 27.5,17.05 U3.45
XTAL1  (via drill 0.3)
  Top 0.15: Q4.1 32.6,17.85 32.65,17.8 C1.1 32.6,16.55 32.6,16.3 v32.05,15.75 | v31.3,15 31.15,15 U3.37
  Bottom 0.15: v31.3,15 v32.05,15.75
XTAL2  (via drill 0.3)
  Top 0.15: C2.1 31.35,19.25 31.4,19.3 Q4.3 31.35,19.35 31.35,20.2 v31.3,20.25 | v30.55,16.65 30.55,15.65 30.3,15.4 U3.38
  Bottom 0.15: v31.3,20.25 31.3,17.4 v30.55,16.65
(copper drawn outside any net)
  shapes: Top area x1

### Text on the board
Bottom: Blue_Sparrow_1.0
tNames: U$2 | IC3
bStop: Blue_Sparrow_1.0